# Altium schematic sheet Farm Assistor.SchDoc
size A4; SheetNumber: 1; SheetTotal: 5
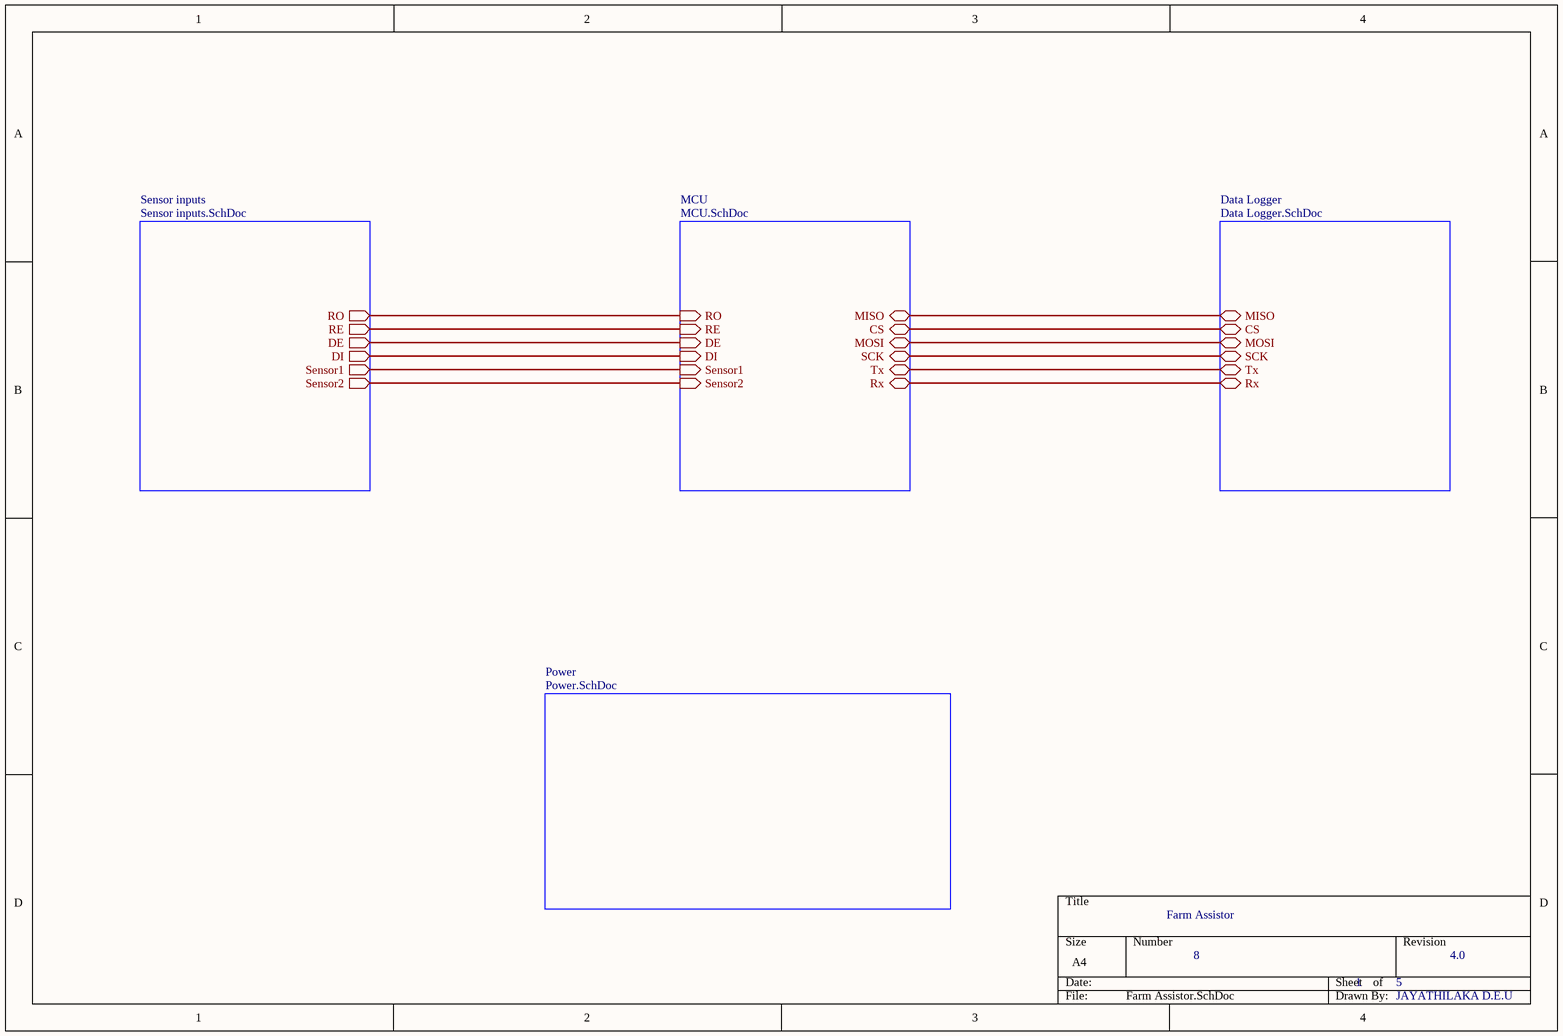
[diagram p0: Farm Assistor.SchDoc]

## Sub-sheets
Data Logger = Data Logger.SchDoc: MISO (bidir), CS (bidir), MOSI (bidir), SCK (bidir), Tx (bidir), Rx (bidir)
MCU = MCU.SchDoc: MISO (bidir), CS (bidir), MOSI (bidir), SCK (bidir), RO (in), RE (in), DE (in), DI (in), Sensor1 (in), Sensor2 (in), Tx (bidir), Rx (bidir)
Power = Power.SchDoc: no entries
Sensor inputs = Sensor inputs.SchDoc: RO (out), RE (out), DE (out), DI (out), Sensor1 (out), Sensor2 (out)

## Nets
(unnamed): sheet Sensor inputs/RO, sheet MCU/RO
(unnamed): sheet Sensor inputs/RE, sheet MCU/RE
(unnamed): sheet Sensor inputs/DE, sheet MCU/DE
(unnamed): sheet Sensor inputs/DI, sheet MCU/DI
(unnamed): sheet Sensor inputs/Sensor1, sheet MCU/Sensor1
(unnamed): sheet Sensor inputs/Sensor2, sheet MCU/Sensor2
(unnamed): sheet MCU/MISO, sheet Data Logger/MISO
(unnamed): sheet MCU/CS, sheet Data Logger/CS
(unnamed): sheet MCU/MOSI, sheet Data Logger/MOSI
(unnamed): sheet MCU/SCK, sheet Data Logger/SCK
(unnamed): sheet MCU/Tx, sheet Data Logger/Tx
(unnamed): sheet MCU/Rx, sheet Data Logger/Rx

## Notes on the sheet
- Farm Assistor
- 8
- 1
- 5
- 4.0
- JAYATHILAKA D.E.U